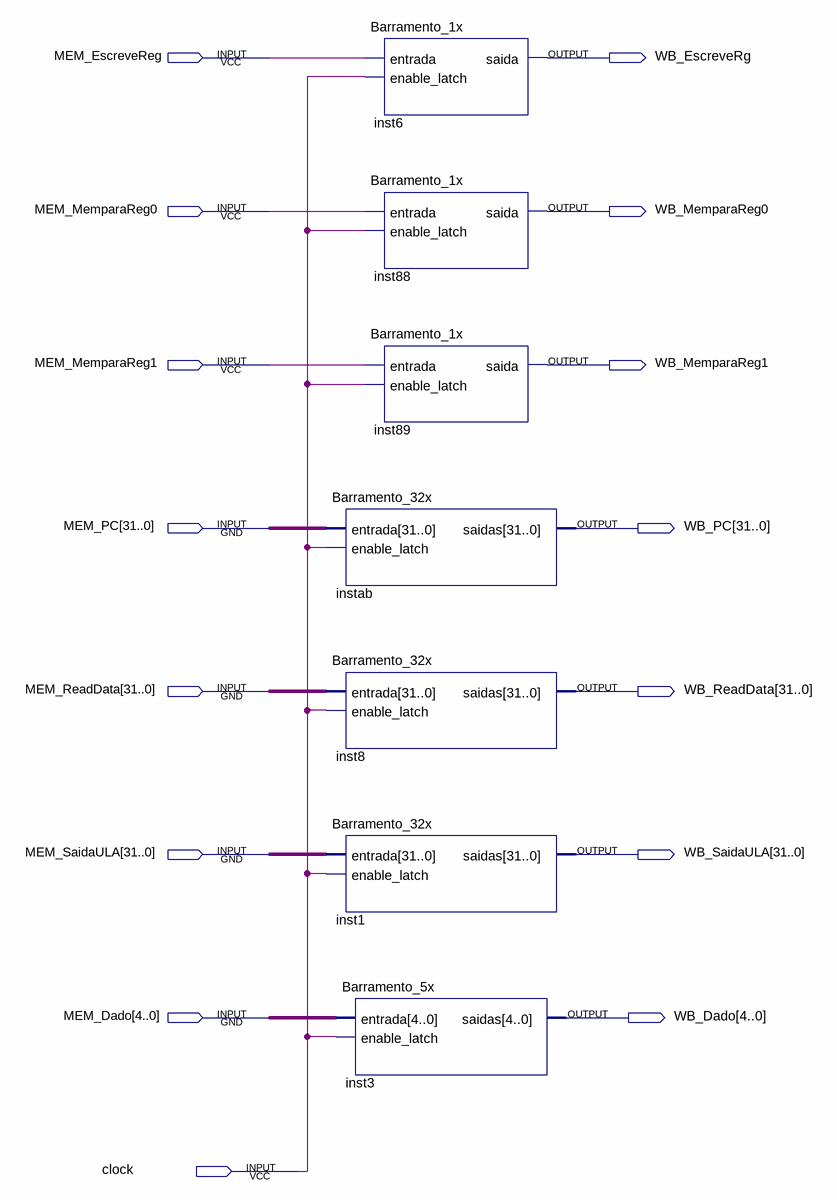
[diagram p0: schematic sheet]
// Quartus schematic MEM_WB.bdf as structural Verilog: 7 symbols, 15 pins
module MEM_WB (
  input  MEM_EscreveReg,
  input  MEM_MemparaReg0,
  input  MEM_MemparaReg1,
  input  [31:0] MEM_PC,
  input  [31:0] MEM_ReadData,
  input  [31:0] MEM_SaidaULA,
  input  [4:0] MEM_Dado,
  input  clock,
  output WB_EscreveRg,
  output WB_MemparaReg0,
  output WB_MemparaReg1,
  output [31:0] WB_PC,
  output [31:0] WB_ReadData,
  output [31:0] WB_SaidaULA,
  output [4:0] WB_Dado
);

  Barramento_1x inst6 (.entrada(MEM_EscreveReg), .enable_latch(clock), .saida(WB_EscreveRg));
  Barramento_1x inst88 (.entrada(MEM_MemparaReg0), .enable_latch(clock), .saida(WB_MemparaReg0));
  Barramento_1x inst89 (.entrada(MEM_MemparaReg1), .enable_latch(clock), .saida(WB_MemparaReg1));
  Barramento_32x instab (.entrada(MEM_PC), .enable_latch(clock), .saidas(WB_PC));
  Barramento_32x inst8 (.entrada(MEM_ReadData), .enable_latch(clock), .saidas(WB_ReadData));
  Barramento_32x inst1 (.entrada(MEM_SaidaULA), .enable_latch(clock), .saidas(WB_SaidaULA));
  Barramento_5x inst3 (.entrada(MEM_Dado), .enable_latch(clock), .saidas(WB_Dado));
endmodule
